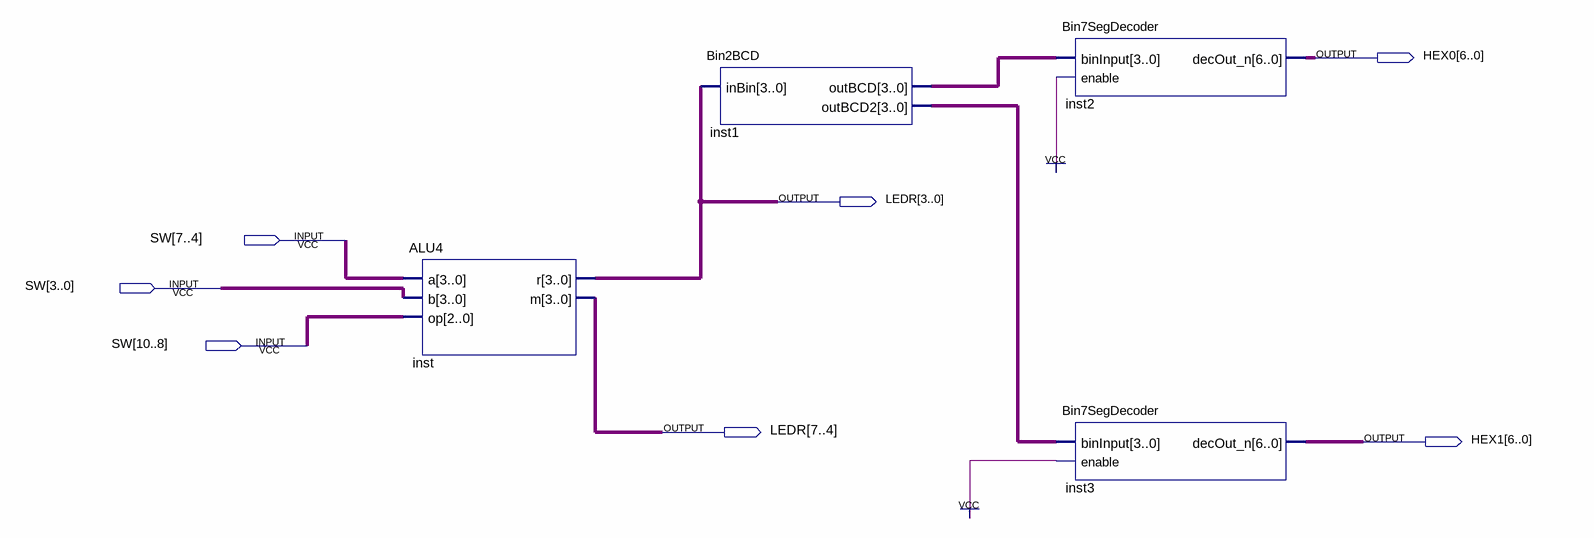
[diagram p0: schematic sheet]
// Quartus schematic ALUDemo.bdf as structural Verilog: 4 symbols, 7 pins
module ALUDemo (
  input  [10:0] SW,
  output [6:0] HEX0,
  output [7:0] LEDR,
  output [6:0] HEX1
);

  wire [3:0] inst1_outbcd, inst1_outbcd2;

  ALU4 inst (.a(SW[7:4]), .b(SW[3:0]), .op(SW[10:8]), .r(LEDR[3:0]), .m(LEDR[7:4]));
  Bin2BCD inst1 (.inBin(LEDR[3:0]), .outBCD(inst1_outbcd), .outBCD2(inst1_outbcd2));
  Bin7SegDecoder inst2 (.binInput(inst1_outbcd), .enable(1'b1), .decOut_n(HEX0));
  Bin7SegDecoder inst3 (.binInput(inst1_outbcd2), .enable(1'b1), .decOut_n(HEX1));
endmodule
